# EAGLE schematic hap (EAGLE 7.1.0)

## Sheet 1 of 3
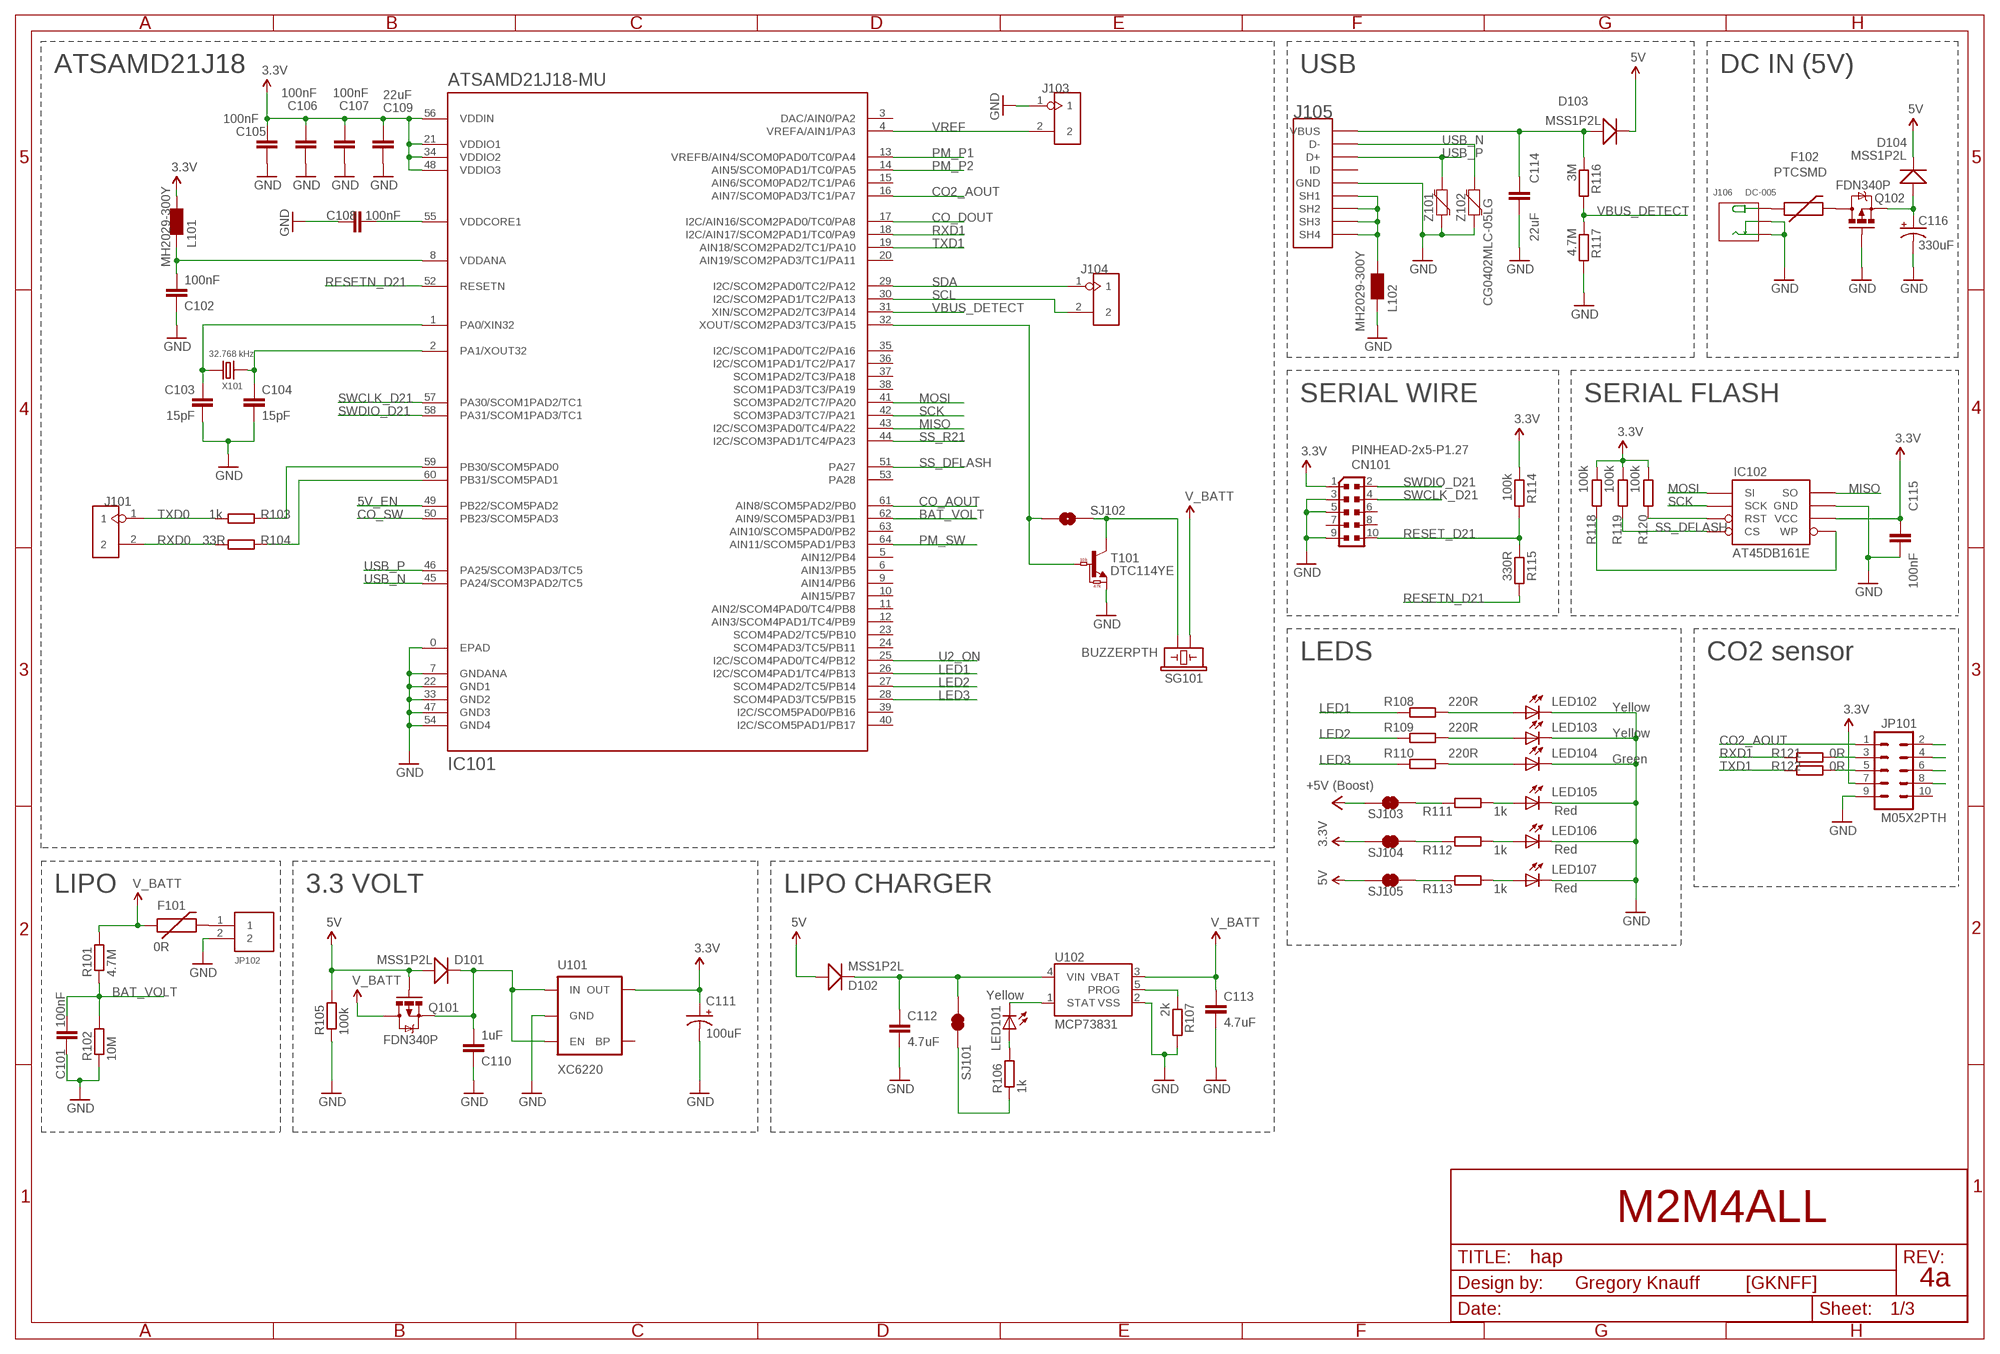
[diagram p0: schematic, sheet 1]

### Parts
C101  100nF  C_0402  [C0402]
C102  100nF  C_0402  [C0402]
C103  15pF  C_0402  [C0402]
C104  15pF  C_0402  [C0402]
C105  100nF  C_0402  [C0402]
C106  100nF  C_0402  [C0402]
C107  100nF  C_0402  [C0402]
C108  100nF  C_0402  [C0402]
C109  22uF  CAP0805  [0805]
C110  1uF  C_0603  [C0603]
C111  100uF  CAP_POL1206  [EIA3216]
C112  4.7uF  C_0603  [C0603]
C113  4.7uF  C_0603  [C0603]
C114  22uF  CAP0805  [0805]
C115  100nF  C_0402  [C0402]
C116  330uF  CAP_POL7343  [EIA7343]
CN101  PINHEAD-2x5-P1.27  0171_PH127-205DF055G00AROUND-PADS  [PINHEAD_2X05_127]
D101  MSS1P2L  D'1005'  [D1005]
D102  MSS1P2L  D'1005'  [D1005]
D103  MSS1P2L  D'1005'  [D1005]
D104  MSS1P2L  D'1005'  [D1005]
F101  0R  PTCSMD  [PTC-1206]
F102  PTCSMD  [PTC-1206]
IC101  ATSAMD21J18-MU  [QFN64]
IC102  AT45DB161E  AT45DB041B  [SO08]
J101  HEADER-2P-2.0  [2P-2.0]
J103  HEADER-2P-2.0  [2P-2.0]
J104  HEADER-2P-2.0  [2P-2.0]
J105  ZX62D-B-5P8-JUNK  [ZX62D-B-5P8]
J106  DC-005  712RA  [712-22-23_RA]
JP101  M05X2PTH  [AVR_ICSP]
JP102  JST_EPH_2PIN  [JST_EPH_B2B-PH-K-S]
L101  MH2029-300Y  0001_BLM21PG300SN1D_/_MH2029-300Y  [0805]
L102  MH2029-300Y  0001_BLM21PG300SN1D_/_MH2029-300Y  [0805]
LED101  Yellow  LED0603  [LED-0603]
LED102  Yellow  LED1206  [LED-1206]
LED103  Yellow  LED1206  [LED-1206]
LED104  Green  LED1206  [LED-1206]
LED105  Red  LED0603  [LED-0603]
LED106  Red  LED0603  [LED-0603]
LED107  Red  LED0603  [LED-0603]
Q101  FDN340P  MOSFET-P-CHANNELSMALL  [SOT23-S-PADS]
Q102  FDN340P  MOSFET-P-CHANNELSMALL  [SOT23-S-PADS]
R101  4.7M  R_0402  [R0402]
R102  10M  R_0402  [R0402]
R103  1k  R_0402  [R0402]
R104  33R  R_0402  [R0402]
R105  100k  R_0402  [R0402]
R106  1k  R_0402  [R0402]
R107  2k  R_0402  [R0402]
R108  220R  R_0603  [R0603]
R109  220R  R_0603  [R0603]
R110  220R  R_0603  [R0603]
R111  1k  R_0402  [R0402]
R112  1k  R_0402  [R0402]
R113  1k  R_0402  [R0402]
R114  100k  R_0402  [R0402]
R115  330R  R_0402  [R0402]
R116  3M  R_0402  [R0402]
R117  4.7M  R_0402  [R0402]
R118  100k  R_0402  [R0402]
R119  100k  R_0402  [R0402]
R120  100k  R_0402  [R0402]
R121  0R  R_0402  [R0402]
R122  0R  R_0402  [R0402]
SG101  BUZZERPTH  [BUZZER-12MM]
SJ101  SOLDERJUMPER_NC  [SJ_2S_NC]
SJ102  SOLDERJUMPER_NO  [SJ_2S_NO]
SJ103  SOLDERJUMPER_NC  [SJ_2S_NC]
SJ104  SOLDERJUMPER_NC  [SJ_2S_NC]
SJ105  SOLDERJUMPER_NC  [SJ_2S_NC]
T101  DTC114YE  [SC-75-3]
U101  XC6220  V_REG_LDOSMD  [SOT23-5]
U102  MCP73831  [SOT23-5]
X101  32.768 kHz  CRYSTAL-3215  [2P-SMD-3.2X1.5]
Z101  CG0402MLC-05LG  VARISTOR-0402  [0402-RES]
Z102  CG0402MLC-05LG  VARISTOR-0402  [0402-RES]

### Nets
3.3V: C105.2 C106.2 C107.2 C109.2 C111.A(+) C115.2 CN101.1 IC101.21(VDDIO1) IC101.34(VDDIO2) IC101.48(VDDIO3) IC101.56(VDDIN) IC102.6(VCC) JP101.7 L101.2 R114.1 R118.2 R119.2 R120.2 SJ104.2 U101.5(OUT) ; also sheet 2,3
5V: D101.+ D102.+ D103.- D104.- Q101.1(G) R105.2 SJ105.2
5V_EN: IC101.49(PB22/SCOM5PAD2) ; also sheet 3
+5V: SJ103.2 ; supply symbol labelled +5V (Boost) ; also sheet 3
BAT_VOLT: C101.2 IC101.62(AIN9/SCOM5PAD3/PB1) R101.1 R102.2
CO2_AOUT: IC101.16(AIN7/SCOM0PAD3/TC1/PA7) JP101.1
CO_AOUT: IC101.61(AIN8/SCOM5PAD2/PB0) ; also sheet 3
CO_DOUT: IC101.17(I2C/AIN16/SCOM2PAD0/TC0/PA8)
CO_SW: IC101.50(PB23/SCOM5PAD3) ; also sheet 3
GND: C101.1 C102.2 C103.1 C104.2 C105.1 C106.1 C107.1 C108.1 C109.1 C110.1 C111.C(-) C112.2 C113.2 C114.2 C115.1 C116.C(-) CN101.3 CN101.5 CN101.9 IC101.0(EPAD) IC101.7(GNDANA) IC101.22(GND1) IC101.33(GND2) IC101.47(GND3) IC101.54(GND4) IC102.7(GND) J103.1 J105.P$5(GND) J106.SLEEVE(-) J106.SLEEVE_SHUNT(CDN) JP101.9 JP102.2 L102.1 LED102.C LED103.C LED104.C LED105.C LED106.C LED107.C Q102.1(G) R102.1 R105.1 R107.2 R117.2 T101.2(E) U101.2(GND) U102.2(VSS) Z101.1 Z102.1 ; also sheet 2,3
LED1: IC101.26(I2C/SCOM4PAD1/TC4/PB13) R108.1
LED2: IC101.27(SCOM4PAD2/TC5/PB14) R109.1
LED3: IC101.28(SCOM4PAD3/TC5/PB15) R110.1
LIPO_STAT: LED101.C U102.1(STAT)
MISO: IC101.43(I2C/SCOM3PAD0/TC4/PA22) IC102.8(SO) ; also sheet 3
MOSI: IC101.41(SCOM3PAD2/TC7/PA20) IC102.1(SI) ; also sheet 3
N$1: IC102.5(WP) R118.1
N$2: LED104.A R110.2
N$4: LED103.A R109.2
N$5: IC102.3(RST) R120.1
N$10: F101.2 JP102.1
N$11: C110.2 D101.- Q101.2(S) U101.1(IN) U101.3(EN)
N$13: LED101.A R106.2
N$14: R107.1 U102.5(PROG)
N$15: C112.1 D102.- SJ101.2 U102.4(VIN)
N$16: R106.1 SJ101.1
N$37: JP101.2
N$39: JP101.4
N$40: JP101.6
N$41: JP101.8
N$42: LED102.A R108.2
N$45: JP101.5 R122.2
N$46: JP101.3 R121.1
N$47: LED105.A R111.2
N$48: LED106.A R112.2
N$49: LED107.A R113.2
N$50: SG101.- SJ102.1 T101.3(C)
N$51: IC101.32(XOUT/SCOM2PAD3/TC3/PA15) SJ102.2 T101.1(B)
N$54: F102.1 J106.CENTER_PIN(+)
N$55: C114.1 D103.+ J105.P$1(VBUS) R116.1
N$56: C116.A(+) D104.+ Q102.2(S)
N$60: IC101.59(PB30/SCOM5PAD0) R103.1
N$61: IC101.60(PB31/SCOM5PAD1) R104.2
N$62: F102.2 Q102.3(D)
N$64: R113.1 SJ105.1
N$65: R112.1 SJ104.1
N$66: R111.1 SJ103.1
N$88: C108.2 IC101.55(VDDCORE1)
N$89: C102.1 IC101.8(VDDANA) L101.1
N$90: C103.2 IC101.1(PA0/XIN32) X101.1
N$91: C104.1 IC101.2(PA1/XOUT32) X101.2
PM_P1: IC101.13(VREFB/AIN4/SCOM0PAD0/TC0/PA4) ; also sheet 3
PM_P2: IC101.14(AIN5/SCOM0PAD1/TC0/PA5) ; also sheet 3
PM_SW: IC101.64(AIN11/SCOM5PAD1/PB3) ; also sheet 3
RESET_D21: CN101.10 R114.2 R115.1
RESETN_D21: IC101.52(RESETN) R115.2
RXD0: J101.2 R104.1 ; also sheet 2
RXD1: IC101.18(I2C/AIN17/SCOM2PAD1/TC0/PA9) R121.2
SCK: IC101.42(SCOM3PAD3/TC7/PA21) IC102.2(SCK) ; also sheet 3
SCL: IC101.30(I2C/SCOM2PAD1/TC2/PA13) J104.2
SDA: IC101.29(I2C/SCOM2PAD0/TC2/PA12) J104.1
SH1: J105.SH1 J105.SH2 J105.SH3 J105.SH4 L102.2
SS_DFLASH: IC101.51(PA27) IC102.4(CS) R119.1
SS_R21: IC101.44(I2C/SCOM3PAD1/TC4/PA23) ; also sheet 3
SWCLK_D21: CN101.4 IC101.57(PA30/SCOM1PAD2/TC1)
SWDIO_D21: CN101.2 IC101.58(PA31/SCOM1PAD3/TC1)
TXD0: J101.1 R103.2 ; also sheet 2
TXD1: IC101.19(AIN18/SCOM2PAD2/TC1/PA10) R122.1
U2_ON: IC101.25(I2C/SCOM4PAD0/TC4/PB12) ; also sheet 2
USB_N: IC101.45(PA24/SCOM3PAD2/TC5) J105.P$2(D-) Z102.2
USB_P: IC101.46(PA25/SCOM3PAD3/TC5) J105.P$3(D+) Z101.2
V_BATT: C113.1 F101.1 Q101.3(D) R101.2 SG101.+ U102.3(VBAT) ; also sheet 2,3
VBUS_DETECT: IC101.31(XIN/SCOM2PAD2/TC3/PA14) R116.2 R117.1
VREF: IC101.4(VREFA/AIN1/PA3) J103.2
Unconnected: CN101.6 CN101.7 CN101.8 IC101.3(DAC/AIN0/PA2) IC101.5(AIN12/PB4) IC101.6(AIN13/PB5) IC101.9(AIN14/PB6) IC101.10(AIN15/PB7) IC101.11(AIN2/SCOM4PAD0/TC4/PB8) IC101.12(AIN3/SCOM4PAD1/TC4/PB9) IC101.15(AIN6/SCOM0PAD2/TC1/PA6) IC101.20(AIN19/SCOM2PAD3/TC1/PA11) IC101.23(SCOM4PAD2/TC5/PB10) IC101.24(SCOM4PAD3/TC5/PB11) IC101.35(I2C/SCOM1PAD0/TC2/PA16) IC101.36(I2C/SCOM1PAD1/TC2/PA17) IC101.37(SCOM1PAD2/TC3/PA18) IC101.38(SCOM1PAD3/TC3/PA19) IC101.39(I2C/SCOM5PAD0/PB16) IC101.40(I2C/SCOM5PAD1/PB17) IC101.53(PA28) IC101.63(AIN10/SCOM5PAD0/PB2) J105.P$4(ID) JP101.10 U101.4(BP)

### Notes on the sheet
- USB | DC IN (5V)
- ATSAMD21J18
- SERIAL WIRE | SERIAL FLASH
- LEDS | CO2 sensor
- LIPO | 3.3 VOLT | LIPO CHARGER
- M2M4ALL
- 4a

## Sheet 2 of 3
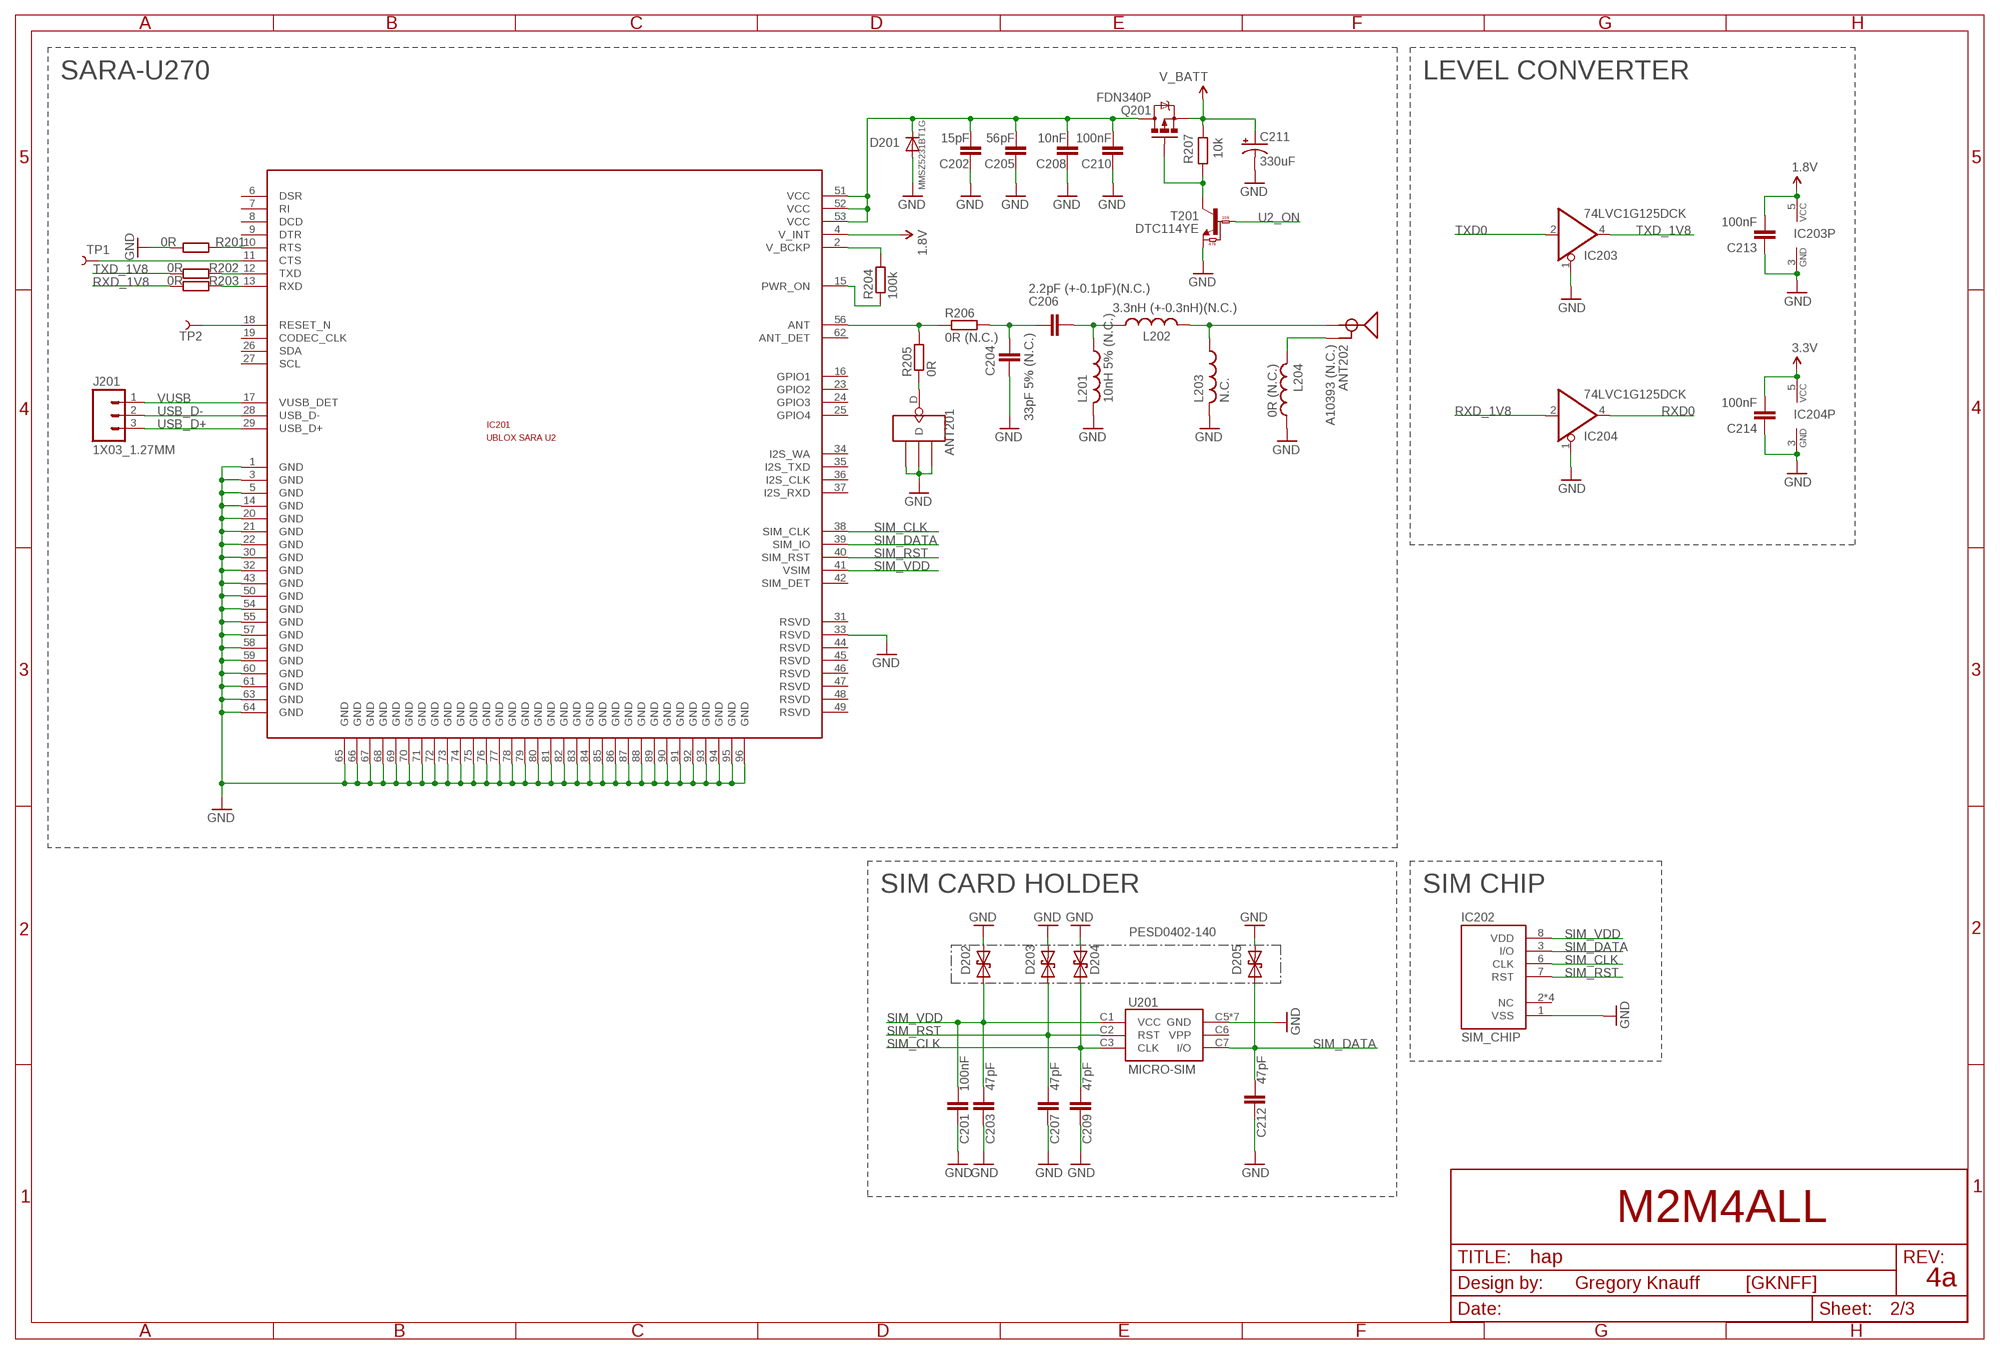
[diagram p1: schematic, sheet 2]

### Parts
ANT201  ANTENNA-U-FL  [4P-U-FL]
ANT202  A10393 (N.C.)  A10393  [A10393]
C201  100nF  C_0402  [C0402]
C202  15pF  C_0402  [C0402]
C203  47pF  C_0402  [C0402]
C204  33pF 5% (N.C.)  C_0603  [C0603]
C205  56pF  C_0402  [C0402]
C206  2.2pF (+-0.1pF)(N.C.)  C_0603  [C0603]
C207  47pF  C_0402  [C0402]
C208  10nF  C_0402  [C0402]
C209  47pF  C_0402  [C0402]
C210  100nF  C_0402  [C0402]
C211  330uF  CAP_POL7343  [EIA7343]
C212  47pF  C_0402  [C0402]
C213  100nF  C_0402  [C0402]
C214  100nF  C_0402  [C0402]
D201  MMSZ5231BT1G  DIODESOD-123  [SOD-123]
D202  PESD0402-140  ESD_DIODE  [R0402]
D203  PESD0402-140  ESD_DIODE  [R0402]
D204  PESD0402-140  ESD_DIODE  [R0402]
D205  PESD0402-140  ESD_DIODE  [R0402]
IC201  UBLOX_SARA_U2STANDARD  [SARA-U2]
IC202  SIM_CHIP  [DFN8]
IC203  74LVC1G125DCK  [SC70-5]
IC204  74LVC1G125DCK  [SC70-5]
J201  1X03_1.27MM  [1X03_1.27MM_NOSILK]
L201  10nH 5% (N.C.)  L_0603  [R0603]
L202  3.3nH (+-0.3nH)(N.C.)  L_0603  [R0603]
L203  N.C.  L_0603  [R0603]
L204  0R (N.C.)  L_0603  [R0603]
Q201  FDN340P  MOSFET-P-CHANNELSMALL  [SOT23-S-PADS]
R201  0R  R_0402  [R0402]
R202  0R  R_0402  [R0402]
R203  0R  R_0402  [R0402]
R204  100k  R_0402  [R0402]
R205  0R  R_0603  [R0603]
R206  0R (N.C.)  R_0603  [R0603]
R207  10k  R_0402  [R0402]
T201  DTC114YE  [SC-75-3]
TP1  TEST-POINT3  [PAD.03X.03]
TP2  TEST-POINT3  [PAD.03X.03]
U201  MICRO-SIM  [MICRO-SIM]

### Nets
1.8V: C213.2 IC201.4(V_INT) IC203.5(VCC)
3.3V: C214.2 IC204.5(VCC) ; also sheet 1,3
GND: ANT201.GND1 ANT201.GND2 ANT201.GND3 C201.1 C202.1 C203.1 C204.2 C205.1 C207.1 C208.1 C209.1 C210.1 C211.C(-) C212.1 C213.1 C214.1 D201.A D202.2 D203.2 D204.2 D205.2 IC201.1(GND) IC201.3(GND) IC201.5(GND) IC201.14(GND) IC201.20(GND) IC201.21(GND) IC201.22(GND) IC201.30(GND) IC201.32(GND) IC201.33(RSVD) IC201.43(GND) IC201.50(GND) IC201.54(GND) IC201.55(GND) IC201.57(GND) IC201.58(GND) IC201.59(GND) IC201.60(GND) IC201.61(GND) IC201.63(GND) IC201.64(GND) IC201.65(GND) IC201.66(GND) IC201.67(GND) IC201.68(GND) IC201.69(GND) IC201.70(GND) IC201.71(GND) IC201.72(GND) IC201.73(GND) IC201.74(GND) IC201.75(GND) IC201.76(GND) IC201.77(GND) IC201.78(GND) IC201.79(GND) IC201.80(GND) IC201.81(GND) IC201.82(GND) IC201.83(GND) IC201.84(GND) IC201.85(GND) IC201.86(GND) IC201.87(GND) IC201.88(GND) IC201.89(GND) IC201.90(GND) IC201.91(GND) IC201.92(GND) IC201.93(GND) IC201.94(GND) IC201.95(GND) IC201.96(GND) IC202.1(VSS) IC203.1(OE) IC203.3(GND) IC204.1(OE) IC204.3(GND) L201.2 L203.2 L204.1 R201.2 T201.2(E) U201.C5(GND) U201.GND@0(GND) U201.GND@1(GND) U201.GND@2(GND) U201.GND@3(GND) U201.GND@4(GND) U201.GND@5(GND) ; also sheet 1,3
N$9: IC201.56(ANT) R205.2 R206.1
N$12: ANT201.D R205.1
N$17: C204.1 C206.1 R206.2
N$23: C206.2 L201.1 L202.1
N$24: IC201.15(PWR_ON) R204.1
N$25: IC201.2(V_BCKP) R204.2
N$26: Q201.1(G) R207.2 T201.3(C)
N$27: IC201.10(RTS) R201.1
N$28: IC201.11(CTS) TP1.P$1
N$29: IC201.18(RESET_N) TP2.P$1
N$30: IC201.13(RXD) R203.1
N$31: IC201.12(TXD) R202.1
N$32: ANT202.1(SIGNAL) L202.2 L203.1
N$33: C202.2 C205.2 C208.2 C210.2 D201.C IC201.51(VCC) IC201.52(VCC) IC201.53(VCC) Q201.3(D)
N$34: ANT202.2(GND) L204.2
RXD0: IC204.4(O) ; also sheet 1
RXD_1V8: IC204.2(I) R203.2
SIM_CLK: C209.2 D204.1 IC201.38(SIM_CLK) IC202.6(CLK) U201.C3(CLK)
SIM_DATA: C212.2 D205.1 IC201.39(SIM_IO) IC202.3(I/O) U201.C7(I/O)
SIM_RST: C207.2 D203.1 IC201.40(SIM_RST) IC202.7(RST) U201.C2(RST)
SIM_VDD: C201.2 C203.2 D202.1 IC201.41(VSIM) IC202.8(VDD) U201.C1(VCC)
TXD0: IC203.2(I) ; also sheet 1
TXD_1V8: IC203.4(O) R202.2
U2_ON: T201.1(B) ; also sheet 1
USB_D+: IC201.29(USB_D+) J201.3
USB_D-: IC201.28(USB_D-) J201.2
V_BATT: C211.A(+) Q201.2(S) R207.1 ; also sheet 1,3
VUSB: IC201.17(VUSB_DET) J201.1
Unconnected: ANT202.3(NC) ANT202.4(NC) ANT202.5(NC) ANT202.6(NC) ANT202.7(NC) ANT202.8(NC) ANT202.9(NC) ANT202.10(NC) ANT202.11(NC) ANT202.12(NC) IC201.6(DSR) IC201.7(RI) IC201.8(DCD) IC201.9(DTR) IC201.16(GPIO1) IC201.19(CODEC_CLK) IC201.23(GPIO2) IC201.24(GPIO3) IC201.25(GPIO4) IC201.26(SDA) IC201.27(SCL) IC201.31(RSVD) IC201.34(I2S_WA) IC201.35(I2S_TXD) IC201.36(I2S_CLK) IC201.37(I2S_RXD) IC201.42(SIM_DET) IC201.44(RSVD) IC201.45(RSVD) IC201.46(RSVD) IC201.47(RSVD) IC201.48(RSVD) IC201.49(RSVD) IC201.62(ANT_DET) IC202.2(NC) IC202.4(NC) IC202.5(NC) IC202.9(NC) U201.C6(VPP)

### Notes on the sheet
- SARA-U270
- LEVEL CONVERTER
- SIM CARD HOLDER | SIM CHIP
- M2M4ALL
- 4a

## Sheet 3 of 3
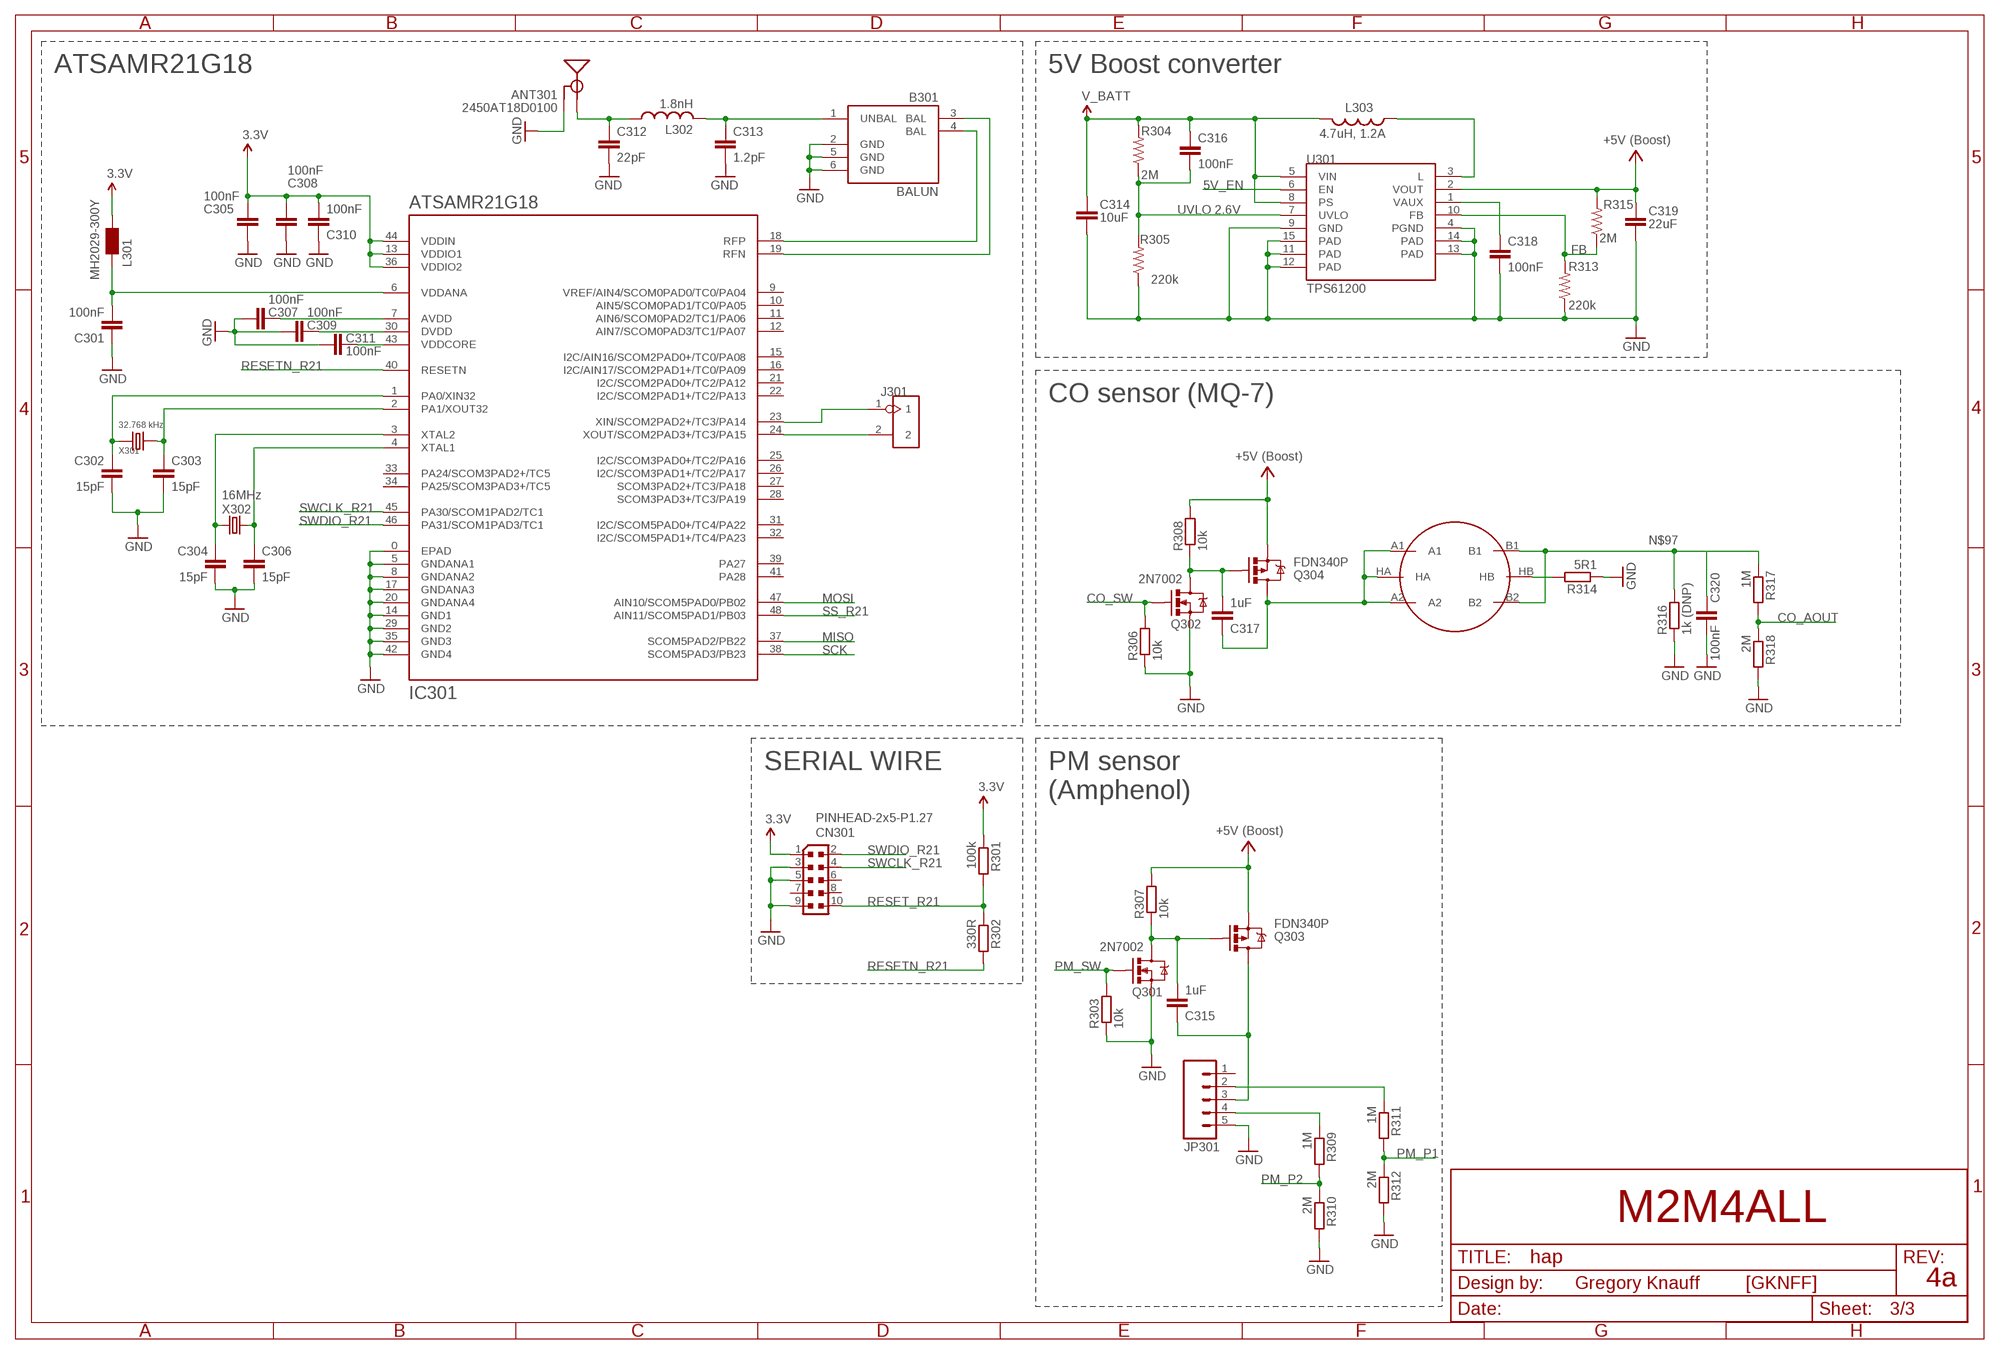
[diagram p2: schematic, sheet 3]

### Parts
ANT301  2450AT18D0100  [2450AT18D0100]
B301  BALUN  [BALUN]
C301  100nF  C_0402  [C0402]
C302  15pF  C_0402  [C0402]
C303  15pF  C_0402  [C0402]
C304  15pF  C_0402  [C0402]
C305  100nF  C_0402  [C0402]
C306  15pF  C_0402  [C0402]
C307  100nF  C_0402  [C0402]
C308  100nF  C_0402  [C0402]
C309  100nF  C_0402  [C0402]
C310  100nF  C_0402  [C0402]
C311  100nF  C_0402  [C0402]
C312  22pF  C_0402  [C0402]
C313  1.2pF  C_0402  [C0402]
C314  10uF  CAP1206  [1206]
C315  1uF  C_0402  [C0402]
C316  100nF  CAP0603-CAP  [0603-CAP]
C317  1uF  C_0402  [C0402]
C318  100nF  CAP0603-CAP  [0603-CAP]
C319  22uF  CAP0805  [0805]
C320  100nF  C_0402  [C0402]
CN301  PINHEAD-2x5-P1.27  0171_PH127-205DF055G00AROUND-PADS  [PINHEAD_2X05_127]
IC301  ATSAMR21G18  [QFN48_SMALL-CPAD]
J301  HEADER-2P-2.0  [2P-2.0]
JP301  M05PTH  [1X05]
L301  MH2029-300Y  0001_BLM21PG300SN1D_/_MH2029-300Y  [0805]
L302  1.8nH  L_0402  [L0402]
L303  4.7uH, 1.2A  INDUCTOR.  [CDRH2D09]
Q301  2N7002  MOSFET-N-CHANNELSMALL  [SOT23-S-PADS]
Q302  2N7002  MOSFET-N-CHANNELSMALL  [SOT23-S-PADS]
Q303  FDN340P  MOSFET-P-CHANNELSMALL  [SOT23-S-PADS]
Q304  FDN340P  MOSFET-P-CHANNELSMALL  [SOT23-S-PADS]
R301  100k  R_0402  [R0402]
R302  330R  R_0402  [R0402]
R303  10k  R_0402  [R0402]
R304  2M  RESISTOR0603-RES  [0603-RES]
R305  220k  RESISTOR0603-RES  [0603-RES]
R306  10k  R_0402  [R0402]
R307  10k  R_0402  [R0402]
R308  10k  R_0402  [R0402]
R309  1M  R_0402  [R0402]
R310  2M  R_0402  [R0402]
R311  1M  R_0402  [R0402]
R312  2M  R_0402  [R0402]
R313  220k  RESISTOR0603-RES  [0603-RES]
R314  5R1  R_0603  [R0603]
R315  2M  RESISTOR0603-RES  [0603-RES]
R316  1k (DNP)  R_0402  [R0402]
R317  1M  R_0402  [R0402]
R318  2M  R_0402  [R0402]
SENS301  METHANE_SENSOR  [MQ-3]
U301  TPS61200  [QFN-10_PAD]
X301  32.768 kHz  CRYSTAL-3215  [2P-SMD-3.2X1.5]
X302  16MHz  CRYSTAL5X3  [CRYSTAL-SMD-5X3]

### Nets
3.3V: C305.2 C308.2 C310.2 CN301.1 IC301.13(VDDIO1) IC301.36(VDDIO2) IC301.44(VDDIN) L301.2 R301.1 ; also sheet 1,2
5V_EN: U301.6(EN) ; also sheet 1
+5V: C319.1 Q303.2(S) Q304.2(S) R307.2 R308.2 R315.2 U301.2(VOUT) ; supply symbol labelled +5V (Boost) ; also sheet 1
CO_AOUT: R317.2 R318.1 ; also sheet 1
CO_SW: Q302.1(G) R306.2 ; also sheet 1
FB: R313.2 R315.1 U301.10(FB)
GND: ANT301.2(GND) ANT301.3(GND) ANT301.4(GND) B301.2(GND) B301.5(GND) B301.6(GND) C301.2 C302.1 C303.2 C304.2 C305.1 C306.2 C307.2 C308.1 C309.2 C310.1 C311.2 C312.2 C313.2 C314.2 C318.2 C319.2 C320.2 CN301.3 CN301.5 CN301.9 IC301.0(EPAD) IC301.5(GNDANA1) IC301.8(GNDANA2) IC301.14(GND1) IC301.17(GNDANA3) IC301.20(GNDANA4) IC301.29(GND2) IC301.35(GND3) IC301.42(GND4) JP301.5 Q301.2(S) Q302.2(S) R303.1 R305.1 R306.1 R310.2 R312.2 R313.1 R314.1 R316.1 R318.2 U301.4(PGND) U301.9(GND) U301.11(PAD) U301.12(PAD) U301.13(PAD) U301.14(PAD) U301.15(PAD) ; also sheet 1,2
MISO: IC301.37(SCOM5PAD2/PB22) ; also sheet 1
MOSI: IC301.47(AIN10/SCOM5PAD0/PB02) ; also sheet 1
N$3: ANT301.1(SIGNAL) C312.1 L302.1
N$6: IC301.24(XOUT/SCOM2PAD3+/TC3/PA15) J301.2
N$7: B301.1(UNBAL) C313.1 L302.2
N$8: IC301.23(XIN/SCOM2PAD2+/TC3/PA14) J301.1
N$21: B301.4(BAL) IC301.18(RFP)
N$22: B301.3(BAL) IC301.19(RFN)
N$36: R314.2 SENS301.HB
N$43: L303.P$1 U301.3(L)
N$44: C318.1 U301.1(VAUX)
N$67: C317.1 Q304.3(D) SENS301.A1 SENS301.A2 SENS301.HA
N$68: C317.2 Q302.3(D) Q304.1(G) R308.1
N$70: C315.2 Q301.3(D) Q303.1(G) R307.1
N$71: C311.1 IC301.43(VDDCORE)
N$72: C309.1 IC301.30(DVDD)
N$73: C307.1 IC301.7(AVDD)
N$74: C302.2 IC301.1(PA0/XIN32) X301.1
N$75: C303.1 IC301.2(PA1/XOUT32) X301.2
N$76: C301.1 IC301.6(VDDANA) L301.1
N$77: C304.1 IC301.3(XTAL2) X302.1
N$78: C306.1 IC301.4(XTAL1) X302.3
N$83: C315.1 JP301.3 Q303.3(D)
N$97: C320.1 R316.2 R317.1 SENS301.B1 SENS301.B2
N$98: JP301.4 R309.1
N$99: JP301.2 R311.1
PM_P1: R311.2 R312.1 ; also sheet 1
PM_P2: R309.2 R310.1 ; also sheet 1
PM_SW: Q301.1(G) R303.2 ; also sheet 1
RESET_R21: CN301.10 R301.2 R302.1
RESETN_R21: IC301.40(RESETN) R302.2
SCK: IC301.38(SCOM5PAD3/PB23) ; also sheet 1
SS_R21: IC301.48(AIN11/SCOM5PAD1/PB03) ; also sheet 1
SWCLK_R21: CN301.4 IC301.45(PA30/SCOM1PAD2/TC1)
SWDIO_R21: CN301.2 IC301.46(PA31/SCOM1PAD3/TC1)
UVLO: C316.2 R304.1 R305.2 U301.7(UVLO)
V_BATT: C314.1 C316.1 L303.P$2 R304.2 U301.5(VIN) U301.8(PS) ; also sheet 1,2
Unconnected: CN301.6 CN301.7 CN301.8 IC301.9(VREF/AIN4/SCOM0PAD0/TC0/PA04) IC301.10(AIN5/SCOM0PAD1/TC0/PA05) IC301.11(AIN6/SCOM0PAD2/TC1/PA06) IC301.12(AIN7/SCOM0PAD3/TC1/PA07) IC301.15(I2C/AIN16/SCOM2PAD0+/TC0/PA08) IC301.16(I2C/AIN17/SCOM2PAD1+/TC0/PA09) IC301.21(I2C/SCOM2PAD0+/TC2/PA12) IC301.22(I2C/SCOM2PAD1+/TC2/PA13) IC301.25(I2C/SCOM3PAD0+/TC2/PA16) IC301.26(I2C/SCOM3PAD1+/TC2/PA17) IC301.27(SCOM3PAD2+/TC3/PA18) IC301.28(SCOM3PAD3+/TC3/PA19) IC301.31(I2C/SCOM5PAD0+/TC4/PA22) IC301.32(I2C/SCOM5PAD1+/TC4/PA23) IC301.33(PA24/SCOM3PAD2+/TC5) IC301.34(PA25/SCOM3PAD3+/TC5) IC301.39(PA27) IC301.41(PA28) JP301.1

### Notes on the sheet
- 5V Boost converter
- ATSAMR21G18
- UVLO 2.6V
- CO sensor (MQ-7)
- SERIAL WIRE
- PM sensor
  (Amphenol)
- M2M4ALL
- 4a

## Library data of the parts
ANT201 = Seeed_Connector:ANTENNA-U-FL
ANT202 = gknff:A10393
ANT301 = gknff:2450AT18D0100
B301 = gknff:BALUN
C101-C108 C110 C112 C113 C115 C201-C210 C212-C214 C301-C313 C315 C317 C320 = gknff:C
C109 C114 C314 C319 = CH_passive:CAP: Capacitor Standard 0603 ceramic capacitor, and 0.1" leaded capacitor.
C111 C116 C211 = SparkFun-Capacitors:CAP_POL: Capacitor Polarized These are standard SMD and PTH capacitors. Normally 10uF, 47uF, and 100uF in electrolytic and tantalum varieties. Always verify the external diameter of the through hole cap, it varies with capacity, voltage, and manufacturer. The EIA devices should be standard.
C316 C318 = SparkFun:CAP: Capacitor Standard 0603 ceramic capacitor, and 0.1" leaded capacitor.
CN101 CN301 = Connettori:0171_PH127-205DF055G00A: 2x5 PASSO 1,27
D101-D104 = Seeedstudio_Discrete_2:D*
D201 = adafruit:DIODE: Diode SMADIODE - SMA Surface Mount Package 20V 1A Schottky Diode Digikey: 641-1014-6-ND DO-1N4148 - Through Hole Small Current Diode SOD-123 20V 1 A (.5mV Vf) Schottky Diode - Digikey: MBRX120TPMSCT-ND SOD-323 10V 570mA (.38mV Vf, 3ns) Schottky Diode - Digikey: ZLLS410CT-ND SOD-523 30V 30mA Schottky Diode (RB751S-40TE61) - Digikey: RB751S-40TE61CT-ND SOT23-R/W - SOT23 Package (R = Solder Paste/Reflow Ovens, W = Hand-Soldering) BAT54Film 40V 300mA - Digikey: 497-7162-1-ND
D202-D205 = gknff:ESD_DIODE
F101 F102 = SparkFun-PowerIC:PTC: Resettable Fuse PTC Resettable Fuse. Spark Fun Electronics SKU : COM-08357; PROD_ID: RES-11150
IC101 = gknff:ATSAMD21J18
IC102 = SparkFun-DigitalIC:AT45DB041B: 4-Mbit SPI flash memory
IC201 = ublox:UBLOX_SARA_U2
IC202 = gknff:SIM_CHIP
IC203 IC204 = 74xx-little-de:74*1G125: Single Bus Buffer Gate with 3-State Output
IC301 = gknff:ATSAMR21G18
J101 J103 J104 J301 = Seeed_Connector:HEADER-2P
J105 = j_usb_hirose_zx62d-b-5p8:ZX62D-B-5P8-JUNK: Hirose MicroUSB A/B Connector
J106 = gknff:712RA
J201 = gknff:1X03
JP101 = SparkFun-Connectors:M05X2: Header 5x2 Standard 10-pin dual row 0.1" header. Commonly used with AVR-ISP. Use with Spark Fun Electronics SKU: PRT-00778
JP102 = Daughterboard_XMEGA_A3BU_v1.0:JST_EPH_2PIN
JP301 = SparkFun-Connectors:M05: Header 5 Standard 5-pin 0.1" header. Use with straight break away headers (SKU : PRT-00116), right angle break away headers (PRT-00553), swiss pins (PRT-00743), machine pins (PRT-00117), and female headers (PRT-00115). Molex polarized connector foot print use with SKU : PRT-08230 with associated crimp pins and housings.
L101 L102 L301 = Protezione:0001_BLM21PG300SN1D_/_MH2029-300Y: BLM21; MONTHLY_USAGE: _____; PART_NUMBER: BLM21PG300SN1D_/_MH2029-300Y; PRICE: _____; SUPPLIER: _____; TYPE: Protezione
L201-L204 L302 = gknff:L
L303 = SparkFun:INDUCTOR: Inductors Basic Inductor/Choke - 0603 and 1206. Footprints are not proven and vary greatly between part numbers.
LED101-LED107 = SparkFun-LED:LED: LEDs Standard schematic elements and footprints for 5mm, 3mm, 1206, and 0603 sized LEDs. 5mm - Spark Fun Electronics SKU : COM-00529 (and others)
Q101 Q102 Q201 Q303 Q304 = gknff:MOSFET-P-CHANNEL
Q301 Q302 = gknff:MOSFET-N-CHANNEL
R101-R122 R201-R207 R301-R303 R306-R312 R314 R316-R318 = gknff:R
R304 R305 R313 R315 = SparkFun:RESISTOR: Resistor Basic schematic elements and footprints for 0603, 1206, and PTH resistors.
SENS301 = SparkFun-Sensors:METHANE_SENSOR: MQ-4 Methane Gas Sensor SEN-09404
SG101 = SparkFun-Electromechanical:BUZZER: Buzzer 12mm Spark Fun Electronics SKU : Comp-Buzzer
SJ101 SJ103-SJ105 = gknff:SOLDERJUMPER_NC
SJ102 = gknff:SOLDERJUMPER_NO
T101 T201 = gknff:DTC114
TP1 TP2 = SparkFun-Passives:TEST-POINT: Bare copper test points for troubleshooting or ICT
U101 = SparkFun-PowerIC:V_REG_LDO: Voltage Regulator LDO Standard 150mA LDO voltage regulator in SOT-23 layout. Micrel part MIC5205. BP (by-pass) pin is used to lower output noise with 470pF cap.
U102 = SparkFun-PowerIC:MCP73831: Miniature single cell, fully integrated Li-Ion, Li-polymer charge management controller http://ww1.microchip.com/downloads/en/DeviceDoc/21984a.pdf IC-09995; PROD_ID: IC-09995
U201 = GPRSbee:MICRO-SIM: Micro-SIM push-pull module (Molex - 78646)
U301 = SparkFun:TPS61200: DC to DC Booster
X101 X301 = Seeed_Discrete:CRYSTAL*: CRYSTAL
X302 = SparkFun-FreqCtrl:CRYSTAL: Various standard crystals. Proven footprints. Spark Fun Electronics SKU : COM-00534
Z101 Z102 = SparkFun-DiscreteSemi:VARISTOR: Varistor Varistor (Variable resistor) is a nonlinear resistive element of the voltage dependence that resistance changes with applied voltage. Varistor is equivalent with Zener diode of two series connection.